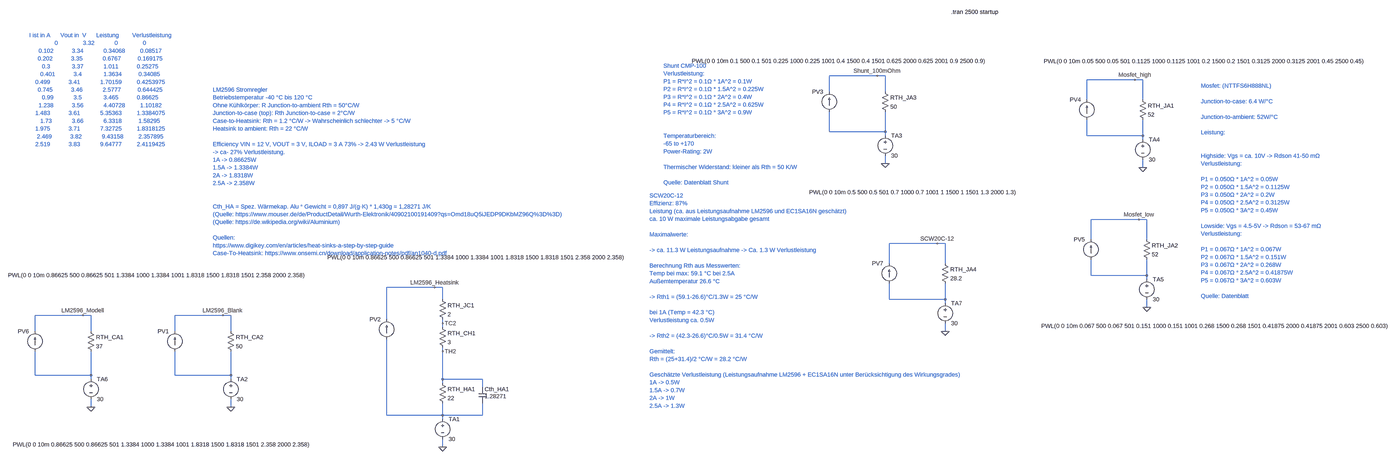
[diagram p0: schematic Thermische_Analyse_Active_Bal.asc, whole sheet]
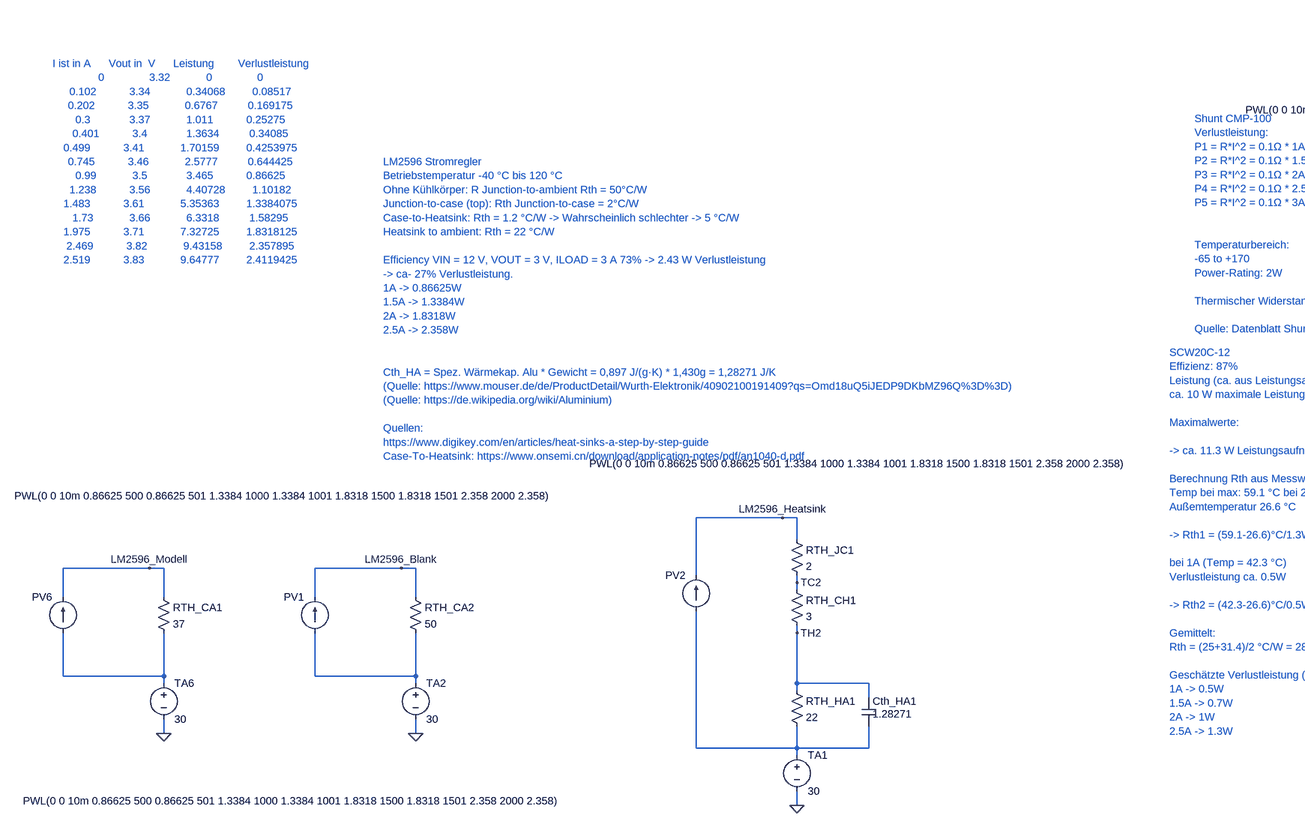
[diagram p1: schematic Thermische_Analyse_Active_Bal.asc, part, row 1 of 1, column 1 of 2]
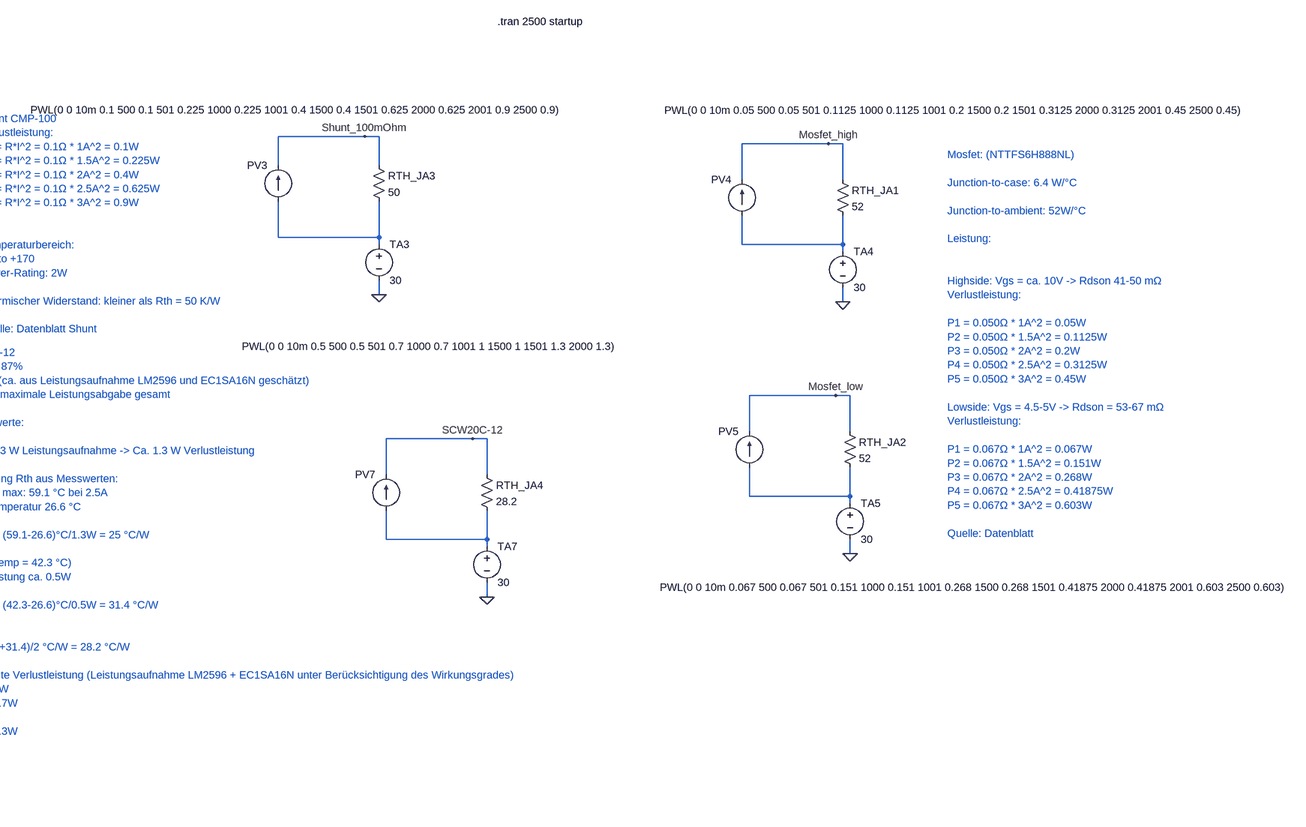
[diagram p2: schematic Thermische_Analyse_Active_Bal.asc, part, row 1 of 1, column 2 of 2]
Thermische_Analyse_Active_Bal.asc, the LTspice schematic file:
Version 4.1
SHEET 1 6248 2340
WIRE 3296 -896 3104 -896
WIRE 3328 -896 3296 -896
WIRE 4784 -880 4592 -880
WIRE 4816 -880 4784 -880
WIRE 3104 -832 3104 -896
WIRE 3328 -832 3328 -896
WIRE 4592 -800 4592 -880
WIRE 4816 -800 4816 -880
WIRE 3104 -672 3104 -752
WIRE 3328 -672 3328 -752
WIRE 3328 -672 3104 -672
WIRE 3328 -656 3328 -672
WIRE 4592 -656 4592 -720
WIRE 4816 -656 4816 -720
WIRE 4816 -656 4592 -656
WIRE 4816 -640 4816 -656
WIRE 3328 -544 3328 -576
WIRE 4816 -528 4816 -560
WIRE 4800 -320 4608 -320
WIRE 4832 -320 4800 -320
WIRE 4608 -240 4608 -320
WIRE 4832 -240 4832 -320
WIRE 3536 -224 3344 -224
WIRE 3568 -224 3536 -224
WIRE 3344 -144 3344 -224
WIRE 3568 -144 3568 -224
WIRE 4608 -96 4608 -160
WIRE 4832 -96 4832 -160
WIRE 4832 -96 4608 -96
WIRE 4832 -80 4832 -96
WIRE 1264 -48 1072 -48
WIRE 1296 -48 1264 -48
WIRE 1296 0 1296 -48
WIRE 3344 0 3344 -64
WIRE 3568 0 3568 -64
WIRE 3568 0 3344 0
WIRE 3568 16 3568 0
WIRE 4832 32 4832 0
WIRE -144 64 -336 64
WIRE -112 64 -144 64
WIRE 416 64 224 64
WIRE 448 64 416 64
WIRE 1072 80 1072 -48
WIRE 1296 96 1296 80
WIRE 1296 112 1296 96
WIRE -336 128 -336 64
WIRE -112 128 -112 64
WIRE 224 128 224 64
WIRE 448 128 448 64
WIRE 3568 128 3568 96
WIRE 1296 208 1296 192
WIRE -336 304 -336 208
WIRE -112 304 -112 208
WIRE -112 304 -336 304
WIRE 224 304 224 208
WIRE 448 304 448 208
WIRE 448 304 224 304
WIRE -112 320 -112 304
WIRE 448 320 448 304
WIRE 1296 320 1296 208
WIRE 1456 320 1296 320
WIRE 1296 336 1296 320
WIRE 1456 352 1456 320
WIRE -112 432 -112 400
WIRE 448 432 448 400
WIRE 1072 464 1072 160
WIRE 1296 464 1296 416
WIRE 1296 464 1072 464
WIRE 1456 464 1456 416
WIRE 1456 464 1296 464
WIRE 1296 480 1296 464
WIRE 1296 592 1296 560
FLAG 1296 592 0
FLAG 1264 -48 LM2596_Heatsink
FLAG 1296 96 TC2
FLAG 1296 208 TH2
FLAG 448 432 0
FLAG 416 64 LM2596_Blank
FLAG 3328 -544 0
FLAG 3296 -896 Shunt_100mOhm
FLAG 4816 -528 0
FLAG 4784 -880 Mosfet_high
FLAG 4832 32 0
FLAG 4800 -320 Mosfet_low
FLAG -112 432 0
FLAG -144 64 LM2596_Modell
FLAG 3568 128 0
FLAG 3536 -224 SCW20C-12
SYMBOL voltage 1296 464 R0
SYMATTR InstName TA1
SYMATTR Value 30
SYMBOL res 1280 96 R0
SYMATTR InstName RTH_CH1
SYMATTR Value 3
SYMBOL res 1280 -16 R0
SYMATTR InstName RTH_JC1
SYMATTR Value 2
SYMBOL current 1072 160 R180
WINDOW 0 24 80 Left 2
WINDOW 3 -964 328 Left 2
WINDOW 123 0 0 Left 0
WINDOW 39 0 0 Left 0
SYMATTR InstName PV2
SYMATTR Value PWL(0 0 10m 0.86625 500 0.86625 501 1.3384 1000 1.3384 1001 1.8318 1500 1.8318 1501 2.358 2000 2.358)
SYMBOL res 1280 320 R0
SYMATTR InstName RTH_HA1
SYMATTR Value 22
SYMBOL cap 1440 352 R0
WINDOW 3 24 36 Left 2
SYMATTR Value 1.28271
SYMATTR InstName Cth_HA1
SYMBOL voltage 448 304 R0
WINDOW 123 0 0 Left 0
WINDOW 39 0 0 Left 0
SYMATTR InstName TA2
SYMATTR Value 30
SYMBOL res 432 112 R0
SYMATTR InstName RTH_CA2
SYMATTR Value 50
SYMBOL current 224 208 R180
WINDOW 0 24 80 Left 2
WINDOW 3 -534 305 Left 2
WINDOW 123 0 0 Left 0
WINDOW 39 0 0 Left 0
SYMATTR InstName PV1
SYMATTR Value PWL(0 0 10m 0.86625 500 0.86625 501 1.3384 1000 1.3384 1001 1.8318 1500 1.8318 1501 2.358 2000 2.358)
SYMBOL voltage 3328 -672 R0
WINDOW 123 0 0 Left 0
WINDOW 39 0 0 Left 0
SYMATTR InstName TA3
SYMATTR Value 30
SYMBOL res 3312 -848 R0
SYMATTR InstName RTH_JA3
SYMATTR Value 50
SYMBOL current 3104 -752 R180
WINDOW 0 24 80 Left 2
WINDOW 3 -638 203 Left 2
WINDOW 123 0 0 Left 0
WINDOW 39 0 0 Left 0
SYMATTR InstName PV3
SYMATTR Value PWL(0 0 10m 0.1 500 0.1 501 0.225 1000 0.225 1001 0.4 1500 0.4 1501 0.625 2000 0.625 2001 0.9 2500 0.9)
SYMBOL voltage 4816 -656 R0
WINDOW 123 0 0 Left 0
WINDOW 39 0 0 Left 0
SYMATTR InstName TA4
SYMATTR Value 30
SYMBOL res 4800 -816 R0
SYMATTR InstName RTH_JA1
SYMATTR Value 52
SYMBOL current 4592 -720 R180
WINDOW 0 24 80 Left 2
WINDOW 3 -1124 234 Left 2
WINDOW 123 0 0 Left 0
WINDOW 39 0 0 Left 0
SYMATTR InstName PV4
SYMATTR Value PWL(0 0 10m 0.05 500 0.05 501 0.1125 1000 0.1125 1001 0.2 1500 0.2 1501 0.3125 2000 0.3125 2001 0.45 2500 0.45)
SYMBOL voltage 4832 -96 R0
WINDOW 123 0 0 Left 0
WINDOW 39 0 0 Left 0
SYMATTR InstName TA5
SYMATTR Value 30
SYMBOL res 4816 -256 R0
SYMATTR InstName RTH_JA2
SYMATTR Value 52
SYMBOL current 4608 -160 R180
WINDOW 0 24 80 Left 2
WINDOW 3 -1206 -267 Left 2
WINDOW 123 0 0 Left 0
WINDOW 39 0 0 Left 0
SYMATTR InstName PV5
SYMATTR Value PWL(0 0 10m 0.067 500 0.067 501 0.151 1000 0.151 1001 0.268 1500 0.268 1501 0.41875 2000 0.41875 2001 0.603 2500 0.603)
SYMBOL voltage -112 304 R0
WINDOW 123 0 0 Left 0
WINDOW 39 0 0 Left 0
SYMATTR InstName TA6
SYMATTR Value 30
SYMBOL res -128 112 R0
SYMATTR InstName RTH_CA1
SYMATTR Value 37
SYMBOL current -336 208 R180
WINDOW 0 24 80 Left 2
WINDOW 3 -1113 -374 Left 2
WINDOW 123 0 0 Left 0
WINDOW 39 0 0 Left 0
SYMATTR InstName PV6
SYMATTR Value PWL(0 0 10m 0.86625 500 0.86625 501 1.3384 1000 1.3384 1001 1.8318 1500 1.8318 1501 2.358 2000 2.358)
SYMBOL voltage 3568 0 R0
WINDOW 123 0 0 Left 0
WINDOW 39 0 0 Left 0
SYMATTR InstName TA7
SYMATTR Value 30
SYMBOL res 3552 -160 R0
SYMATTR InstName RTH_JA4
SYMATTR Value 28.2
SYMBOL current 3344 -64 R180
WINDOW 0 24 80 Left 2
WINDOW 3 -517 365 Left 2
WINDOW 123 0 0 Left 0
WINDOW 39 0 0 Left 0
SYMATTR InstName PV7
SYMATTR Value PWL(0 0 10m 0.5 500 0.5 501 0.7 1000 0.7 1001 1 1500 1 1501 1.3 2000 1.3)
TEXT 376 -840 Left 2 ;LM2596 Stromregler\nBetriebstemperatur -40 °C bis 120 °C\nOhne Kühlkörper: R Junction-to-ambient Rth = 50°C/W\nJunction-to-case (top): Rth Junction-to-case = 2°C/W\nCase-to-Heatsink: Rth = 1.2 °C/W -> Wahrscheinlich schlechter -> 5 °C/W\nHeatsink to ambient: Rth = 22 °C/W\n \nEfficiency VIN = 12 V, VOUT = 3 V, ILOAD = 3 A 73% -> 2.43 W Verlustleistung\n-> ca- 27% Verlustleistung.\n1A -> 0.86625W\n1.5A -> 1.3384W\n2A -> 1.8318W\n2.5A -> 2.358W\n \n \nCth_HA = Spez. Wärmekap. Alu * Gewicht = 0,897 J/(g·K) * 1,430g = 1,28271 J/K\n(Quelle: https://www.mouser.de/de/ProductDetail/Wurth-Elektronik/40902100191409?qs=Omd18uQ5iJEDP9DKbMZ96Q%3D%3D)\n(Quelle: https://de.wikipedia.org/wiki/Aluminium)\n \nQuellen:\nhttps://www.digikey.com/en/articles/heat-sinks-a-step-by-step-guide\nCase-To-Heatsink: https://www.onsemi.cn/download/application-notes/pdf/an1040-d.pdf
TEXT 2440 -936 Left 2 ;Shunt CMP-100\nVerlustleistung:\nP1 = R*I^2 = 0.1Ω * 1A^2 = 0.1W\nP2 = R*I^2 = 0.1Ω * 1.5A^2 = 0.225W\nP3 = R*I^2 = 0.1Ω * 2A^2 = 0.4W\nP4 = R*I^2 = 0.1Ω * 2.5A^2 = 0.625W\nP5 = R*I^2 = 0.1Ω * 3A^2 = 0.9W\n \n \nTemperaturbereich:\n-65 to +170\nPower-Rating: 2W\n \nThermischer Widerstand: kleiner als Rth = 50 K/W\n \nQuelle: Datenblatt Shunt
TEXT 5048 -856 Left 2 ;Mosfet: (NTTFS6H888NL)\n \nJunction-to-case: 6.4 W/°C\n \nJunction-to-ambient: 52W/°C\n \nLeistung:\n \n \nHighside: Vgs = ca. 10V -> Rdson 41-50 mΩ\nVerlustleistung: \n \nP1 = 0.050Ω * 1A^2 = 0.05W\nP2 = 0.050Ω * 1.5A^2 = 0.1125W\nP3 = 0.050Ω * 2A^2 = 0.2W\nP4 = 0.050Ω * 2.5A^2 = 0.3125W\nP5 = 0.050Ω * 3A^2 = 0.45W\n \nLowside: Vgs = 4.5-5V -> Rdson = 53-67 mΩ\nVerlustleistung: \n \nP1 = 0.067Ω * 1A^2 = 0.067W\nP2 = 0.067Ω * 1.5A^2 = 0.151W\nP3 = 0.067Ω * 2A^2 = 0.268W\nP4 = 0.067Ω * 2.5A^2 = 0.41875W\nP5 = 0.067Ω * 3A^2 = 0.603W\n \nQuelle: Datenblatt
TEXT 3592 -1152 Left 2 !.tran 2500 startup
TEXT -72 -840 Center 2 ;I ist in A      Vout in  V      Leistung        Verlustleistung\n0               3.32            0               0\n0.102           3.34            0.34068         0.08517\n0.202           3.35            0.6767          0.169175\n0.3             3.37            1.011           0.25275\n0.401           3.4             1.3634          0.34085\n0.499           3.41            1.70159         0.4253975\n0.745           3.46            2.5777          0.644425\n0.99            3.5             3.465           0.86625\n1.238           3.56            4.40728         1.10182\n1.483           3.61            5.35363         1.3384075\n1.73            3.66            6.3318          1.58295\n1.975           3.71            7.32725         1.8318125\n2.469           3.82            9.43158         2.357895\n2.519           3.83            9.64777         2.4119425
TEXT 2384 -416 Left 2 ;SCW20C-12\nEffizienz: 87%\nLeistung (ca. aus Leistungsaufnahme LM2596 und EC1SA16N geschätzt)\nca. 10 W maximale Leistungsabgabe gesamt\n \nMaximalwerte:\n \n-> ca. 11.3 W Leistungsaufnahme -> Ca. 1.3 W Verlustleistung\n \nBerechnung Rth aus Messwerten:\nTemp bei max: 59.1 °C bei 2.5A\nAußemtemperatur 26.6 °C\n \n-> Rth1 = (59.1-26.6)°C/1.3W = 25 °C/W\n \nbei 1A (Temp = 42.3 °C)\nVerlustleistung ca. 0.5W\n \n-> Rth2 = (42.3-26.6)°C/0.5W = 31.4 °C/W\n \nGemittelt:\nRth = (25+31.4)/2 °C/W = 28.2 °C/W\n \nGeschätzte Verlustleistung (Leistungsaufnahme LM2596 + EC1SA16N unter Berücksichtigung des Wirkungsgrades)\n1A -> 0.5W\n1.5A -> 0.7W\n2A -> 1W\n2.5A -> 1.3W

The netlist it stands for:
* Thermische_Analyse_Active_Bal.asc
V§TA1 N007 0 30
RTH_CH1 TC2 TH2 3
RTH_JC1 LM2596_Heatsink TC2 2
I§PV2 N007 LM2596_Heatsink PWL(0 0 10m 0.86625 500 0.86625 501 1.3384 1000 1.3384 1001 1.8318 1500 1.8318 1501 2.358 2000 2.358)
RTH_HA1 TH2 N007 22
Cth_HA1 TH2 N007 1.28271
V§TA2 N006 0 30
RTH_CA2 LM2596_Blank N006 50
I§PV1 N006 LM2596_Blank PWL(0 0 10m 0.86625 500 0.86625 501 1.3384 1000 1.3384 1001 1.8318 1500 1.8318 1501 2.358 2000 2.358)
V§TA3 N001 0 30
RTH_JA3 Shunt_100mOhm N001 50
I§PV3 N001 Shunt_100mOhm PWL(0 0 10m 0.1 500 0.1 501 0.225 1000 0.225 1001 0.4 1500 0.4 1501 0.625 2000 0.625 2001 0.9 2500 0.9)
V§TA4 N002 0 30
RTH_JA1 Mosfet_high N002 52
I§PV4 N002 Mosfet_high PWL(0 0 10m 0.05 500 0.05 501 0.1125 1000 0.1125 1001 0.2 1500 0.2 1501 0.3125 2000 0.3125 2001 0.45 2500 0.45)
V§TA5 N003 0 30
RTH_JA2 Mosfet_low N003 52
I§PV5 N003 Mosfet_low PWL(0 0 10m 0.067 500 0.067 501 0.151 1000 0.151 1001 0.268 1500 0.268 1501 0.41875 2000 0.41875 2001 0.603 2500 0.603)
V§TA6 N005 0 30
RTH_CA1 LM2596_Modell N005 37
I§PV6 N005 LM2596_Modell PWL(0 0 10m 0.86625 500 0.86625 501 1.3384 1000 1.3384 1001 1.8318 1500 1.8318 1501 2.358 2000 2.358)
V§TA7 N004 0 30
RTH_JA4 SCW20C-12 N004 28.2
I§PV7 N004 SCW20C-12 PWL(0 0 10m 0.5 500 0.5 501 0.7 1000 0.7 1001 1 1500 1 1501 1.3 2000 1.3)
* LM2596 Stromregler
* Betriebstemperatur -40 °C bis 120 °C
* Ohne Kühlkörper: R Junction-to-ambient Rth = 50°C/W
* Junction-to-case (top): Rth Junction-to-case = 2°C/W
* Case-to-Heatsink: Rth = 1.2 °C/W -> Wahrscheinlich schlechter -> 5 °C/W
* Heatsink to ambient: Rth = 22 °C/W
* Efficiency VIN = 12 V, VOUT = 3 V, ILOAD = 3 A 73% -> 2.43 W Verlustleistung
* -> ca- 27% Verlustleistung.
* 1A -> 0.86625W
* 1.5A -> 1.3384W
* 2A -> 1.8318W
* 2.5A -> 2.358W
* Cth_HA = Spez. Wärmekap. Alu * Gewicht = 0,897 J/(g·K) * 1,430g = 1,28271 J/K
* (Quelle: https://www.mouser.de/de/ProductDetail/Wurth-Elektronik/40902100191409?qs=Omd18uQ5iJEDP9DKbMZ96Q%3D%3D)
* (Quelle: https://de.wikipedia.org/wiki/Aluminium)
* Quellen:
* https://www.digikey.com/en/articles/heat-sinks-a-step-by-step-guide
* Case-To-Heatsink: https://www.onsemi.cn/download/application-notes/pdf/an1040-d.pdf
* Shunt CMP-100
* Verlustleistung:
* P1 = R*I^2 = 0.1Ω * 1A^2 = 0.1W
* P2 = R*I^2 = 0.1Ω * 1.5A^2 = 0.225W
* P3 = R*I^2 = 0.1Ω * 2A^2 = 0.4W
* P4 = R*I^2 = 0.1Ω * 2.5A^2 = 0.625W
* P5 = R*I^2 = 0.1Ω * 3A^2 = 0.9W
* Temperaturbereich:
* -65 to +170
* Power-Rating: 2W
* Thermischer Widerstand: kleiner als Rth = 50 K/W
* Quelle: Datenblatt Shunt
* Mosfet: (NTTFS6H888NL)
* Junction-to-case: 6.4 W/°C
* Junction-to-ambient: 52W/°C
* Leistung:
* Highside: Vgs = ca. 10V -> Rdson 41-50 mΩ
* Verlustleistung:
* P1 = 0.050Ω * 1A^2 = 0.05W
* P2 = 0.050Ω * 1.5A^2 = 0.1125W
* P3 = 0.050Ω * 2A^2 = 0.2W
* P4 = 0.050Ω * 2.5A^2 = 0.3125W
* P5 = 0.050Ω * 3A^2 = 0.45W
* Lowside: Vgs = 4.5-5V -> Rdson = 53-67 mΩ
* Verlustleistung:
* P1 = 0.067Ω * 1A^2 = 0.067W
* P2 = 0.067Ω * 1.5A^2 = 0.151W
* P3 = 0.067Ω * 2A^2 = 0.268W
* P4 = 0.067Ω * 2.5A^2 = 0.41875W
* P5 = 0.067Ω * 3A^2 = 0.603W
* Quelle: Datenblatt
.tran 2500 startup
* I ist in A      Vout in  V      Leistung        Verlustleistung
* 0               3.32            0               0
* 0.102           3.34            0.34068         0.08517
* 0.202           3.35            0.6767          0.169175
* 0.3             3.37            1.011           0.25275
* 0.401           3.4             1.3634          0.34085
* 0.499           3.41            1.70159         0.4253975
* 0.745           3.46            2.5777          0.644425
* 0.99            3.5             3.465           0.86625
* 1.238           3.56            4.40728         1.10182
* 1.483           3.61            5.35363         1.3384075
* 1.73            3.66            6.3318          1.58295
* 1.975           3.71            7.32725         1.8318125
* 2.469           3.82            9.43158         2.357895
* 2.519           3.83            9.64777         2.4119425
* SCW20C-12
* Effizienz: 87%
* Leistung (ca. aus Leistungsaufnahme LM2596 und EC1SA16N geschätzt)
* ca. 10 W maximale Leistungsabgabe gesamt
* Maximalwerte:
* -> ca. 11.3 W Leistungsaufnahme -> Ca. 1.3 W Verlustleistung
* Berechnung Rth aus Messwerten:
* Temp bei max: 59.1 °C bei 2.5A
* Außemtemperatur 26.6 °C
* -> Rth1 = (59.1-26.6)°C/1.3W = 25 °C/W
* bei 1A (Temp = 42.3 °C)
* Verlustleistung ca. 0.5W
* -> Rth2 = (42.3-26.6)°C/0.5W = 31.4 °C/W
* Gemittelt:
* Rth = (25+31.4)/2 °C/W = 28.2 °C/W
* Geschätzte Verlustleistung (Leistungsaufnahme LM2596 + EC1SA16N unter Berücksichtigung des Wirkungsgrades)
* 1A -> 0.5W
* 1.5A -> 0.7W
* 2A -> 1W
* 2.5A -> 1.3W
.backanno
.end